# Altium project GPS_TRACKER.PrjPcb (part 2 of 2)

## Sheet SIM808+RF.SchDoc
size B; SheetNumber: 2; SheetTotal: 2
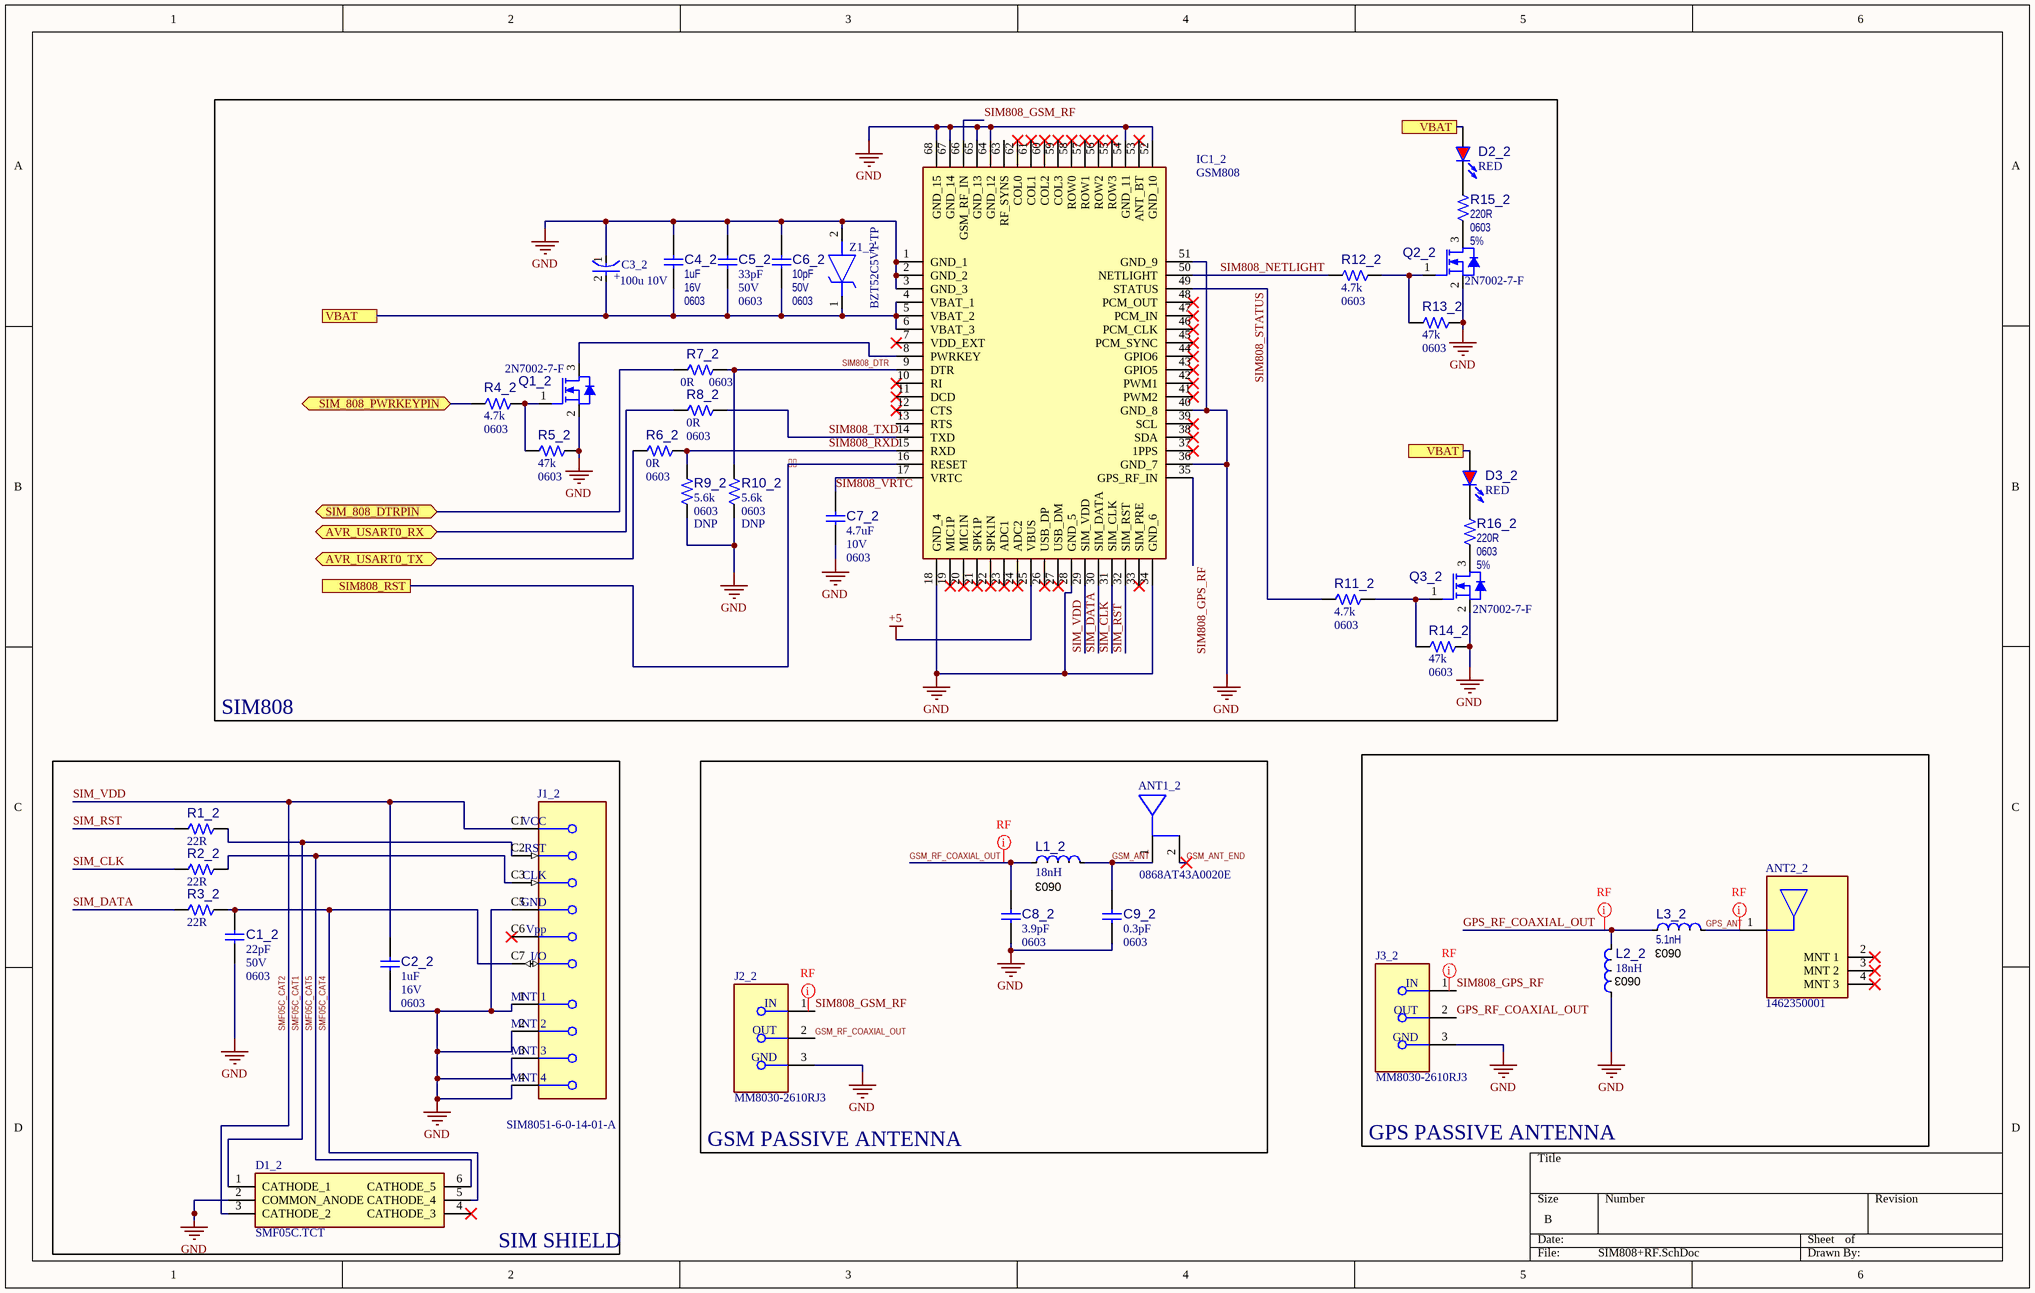
[diagram p1: SIM808+RF.SchDoc]

### Parts
ANT1_2  0868AT43A0020E  [FP-0900AT43A0070E-MFG]
ANT2_2  1462350001  [FP-1462350001-MFG]
C1_2  value 22pF  Voltage: 50V  Package: 0603  [CAP_C_0603]  (hidden comment: Capacitor NP)
C2_2  value 1uF  Voltage: 16V  Package: 0603  [CAP_C_0603]  (hidden comment: Capacitor NP)
C3_2  100u 10V  [FP-TAJC-MFG]
C4_2  value 1uF  Voltage: 16V  Package: 0603  [CAP_C_0603]  (hidden comment: Capacitor NP)
C5_2  value 33pF  Voltage: 50V  Package: 0603  [CAP_C_0603]  (hidden comment: Capacitor NP)
C6_2  value 10pF  Voltage: 50V  Package: 0603  [CAP_C_0603]  (hidden comment: Capacitor NP)
C7_2  value 4.7uF  Voltage: 10V  Package: 0603  [CAP_C_0603]  (hidden comment: Capacitor NP)
C8_2  value 3.9pF  Package: 0603  [CAP_C_0603]  (hidden comment: Capacitor NP)
C9_2  value 0.3pF  Package: 0603  [CAP_C_0603]  (hidden comment: Capacitor NP)
D1_2  SMF05C.TCT  [SOT65P210X110-6N]
D2_2  value RED  [LED_0603_RED]  (hidden comment: LED_red)
D3_2  value RED  [LED_0603_RED]  (hidden comment: LED_red)
IC1_2  GSM808  [GSM808]
J1_2  SIM8051-6-0-14-01-A  [FP-SIM8051-6-0-14-01-A-MFG]
J2_2  MM8030-2610RJ3  [FP-MM8030-2610RJ3-MFG]
J3_2  MM8030-2610RJ3  [FP-MM8030-2610RJ3-MFG]
L1_2  value 18nH  [IND_C_0603]  (hidden comment: Inductor)
L2_2  value 18nH  [IND_C_0603]  (hidden comment: Inductor)
L3_2  value 5.1nH  [IND_C_0603]  (hidden comment: Inductor)
Q1_2  value 2N7002-7-F  [SOT-23-3]  (hidden comment: Transistor MOS-N GSD)
Q2_2  value 2N7002-7-F  [SOT-23-3]  (hidden comment: Transistor MOS-N GSD)
Q3_2  value 2N7002-7-F  [SOT-23-3]  (hidden comment: Transistor MOS-N GSD)
R1_2  value 22R  [RES_C_0603]  (hidden comment: Resistor)
R2_2  value 22R  [RES_C_0603]  (hidden comment: Resistor)
R3_2  value 22R  [RES_C_0603]  (hidden comment: Resistor)
R4_2  value 4.7k  Package: 0603  [RES_C_0603]  (hidden comment: Resistor)
R5_2  value 47k  Package: 0603  [RES_C_0603]  (hidden comment: Resistor)
R6_2  value 0R  Package: 0603  [RES_C_0603]  (hidden comment: Resistor)
R7_2  value 0R  Package: 0603  [RES_C_0603]  (hidden comment: Resistor)
R8_2  value 0R  Package: 0603  [RES_C_0603]  (hidden comment: Resistor)
R9_2  value 5.6k  Package: 0603  Populated: DNP  [RES_C_0603]  (hidden comment: Resistor)
R10_2  value 5.6k  Package: 0603  Populated: DNP  [RES_C_0603]  (hidden comment: Resistor)
R11_2  value 4.7k  Package: 0603  [RES_C_0603]  (hidden comment: Resistor)
R12_2  value 4.7k  Package: 0603  [RES_C_0603]  (hidden comment: Resistor)
R13_2  value 47k  Package: 0603  [RES_C_0603]  (hidden comment: Resistor)
R14_2  value 47k  Package: 0603  [RES_C_0603]  (hidden comment: Resistor)
R15_2  value 220R  Package: 0603  Tolerance: 5%  [RES_C_0603]  (hidden comment: Resistor)
R16_2  value 220R  Package: 0603  Tolerance: 5%  [RES_C_0603]  (hidden comment: Resistor)
Z1_2  BZT52C5V1-TP  [SOD3716X135N]

### Blocks framed on the sheet
SIM808: C3_2 C4_2 C5_2 C6_2 C7_2 D2_2 D3_2 IC1_2 Q1_2 Q2_2 Q3_2 R4_2 R5_2 R6_2 R7_2 R8_2 R9_2 R10_2 R11_2 R12_2 R13_2 R14_2 R15_2 R16_2 Z1_2
SIM SHIELD: C1_2 C2_2 D1_2 J1_2 R1_2 R2_2 R3_2
GSM PASSIVE ANTENNA: ANT1_2 C8_2 C9_2 J2_2 L1_2
GPS PASSIVE ANTENNA: ANT2_2 J3_2 L2_2 L3_2

### Ports
AVR_USART0_RX (bidir), AVR_USART0_TX (bidir), SIM808_RST, SIM_808_DTRPIN (bidir), SIM_808_PWRKEYPIN (bidir), VBAT

### Nets
+5: IC1_2.25(VBUS)
GND: C1_2.1 C2_2.1 C3_2.1(C) C4_2.2 C5_2.1 C6_2.2 C7_2.1 C8_2.1 C9_2.1 D1_2.2(COMMON_ANODE) IC1_2.1(GND_1) IC1_2.2(GND_2) IC1_2.3(GND_3) IC1_2.18(GND_4) IC1_2.28(GND_5) IC1_2.34(GND_6) IC1_2.36(GND_7) IC1_2.40(GND_8) IC1_2.51(GND_9) IC1_2.52(GND_10) IC1_2.54(GND_11) IC1_2.64(GND_12) IC1_2.65(GND_13) IC1_2.67(GND_14) IC1_2.68(GND_15) J1_2.1(MNT_1) J1_2.2(MNT_2) J1_2.3(MNT_3) J1_2.4(MNT_4) J1_2.C5(GND) J2_2.3(GND) J3_2.3(GND) L2_2.1(S) Q1_2.2(S) Q2_2.2(S) Q3_2.2(S) R5_2.2 R9_2.1 R10_2.1 R13_2.2 R14_2.2 Z1_2.2(A)
VBAT: C3_2.2(A) C4_2.1 C5_2.2 C6_2.1 D2_2.1(A) D3_2.1(A) IC1_2.4(VBAT_1) IC1_2.5(VBAT_2) IC1_2.6(VBAT_3) Z1_2.1(K) ; port VBAT
: IC1_2.16(RESET) ; port SIM808_RST
AVR_USART0_RX: R8_2.1 ; port AVR_USART0_RX
AVR_USART0_TX: R6_2.1 ; port AVR_USART0_TX
GPS_ANT: ANT2_2.1(FEEDING_PAD) L3_2.2(F)
GPS_RF_COAXIAL_OUT: J3_2.2(OUT) L2_2.2(F) L3_2.1(S)
GSM_ANT: ANT1_2.1(RF_Feeding_Point) C9_2.2 L1_2.2(F)
GSM_ANT_END: ANT1_2.2(To_trace_element)
GSM_RF_COAXIAL_OUT: C8_2.2 J2_2.2(OUT) L1_2.1(S)
SIM808_DTR: IC1_2.9(DTR) R7_2.2 R10_2.2
SIM808_DTRPIN: R7_2.1 ; port SIM_808_DTRPIN
SIM808_GPS_RF: IC1_2.35(GPS_RF_IN) J3_2.1(IN)
SIM808_GSM_RF: IC1_2.66(GSM_RF_IN) J2_2.1(IN)
SIM808_NETLIGHT: IC1_2.50(NETLIGHT) R12_2.1
SIM808_PWRKEY: R4_2.1 ; port SIM_808_PWRKEYPIN
SIM808_RXD: IC1_2.15(RXD) R6_2.2 R9_2.2
SIM808_STATUS: IC1_2.49(STATUS) R11_2.1
SIM808_TXD: IC1_2.14(TXD) R8_2.2
SIM808_VRTC: C7_2.2 IC1_2.17(VRTC)
SIM_CLK: IC1_2.31(SIM_CLK) R2_2.1
SIM_DATA: IC1_2.30(SIM_DATA) R3_2.1
SIM_RST: IC1_2.32(SIM_RST) R1_2.1
SIM_VDD: C2_2.2 D1_2.3(CATHODE_2) IC1_2.29(SIM_VDD) J1_2.C1(VCC)  [also labelled SMF05C_CAT2]
SMF05C_CAT1: D1_2.1(CATHODE_1) J1_2.C2(RST) R1_2.2
SMF05C_CAT4: C1_2.2 D1_2.5(CATHODE_4) J1_2.C7(I/O) R3_2.2
SMF05C_CAT5: D1_2.6(CATHODE_5) J1_2.C3(CLK) R2_2.2
NetD2_2_2: D2_2.2(K) R15_2.2
NetD3_2_2: D3_2.2(K) R16_2.2
NetIC1_2_8: IC1_2.8(PWRKEY) Q1_2.3(D)
NetQ1_2_1: Q1_2.1(G) R4_2.2 R5_2.1
NetQ2_2_1: Q2_2.1(G) R12_2.2 R13_2.1
NetQ2_2_3: Q2_2.3(D) R15_2.1
NetQ3_2_1: Q3_2.1(G) R11_2.2 R14_2.1
NetQ3_2_3: Q3_2.3(D) R16_2.1

Not connected (* = marked no-connect by the designer): ANT2_2 2(MNT_1)* 3(MNT_2)* 4(MNT_3)*; D1_2 4(CATHODE_3)*; IC1_2 7(VDD_EXT)* 10(RI)* 11(DCD)* 12(CTS)* 13(RTS) 19(MIC1P)* 20(MIC1N)* 21(SPK1P)* 22(SPK1N)* 23(ADC1)* 24(ADC2)* 26(USB_DP)* 27(USB_DM)* 33(SIM_PRE)* 37(1PPS)* 38(SDA)* 39(SCL)* 41(PWM2)* 42(PWM1)* 43(GPIO5)* 44(GPIO6)* 45(PCM_SYNC)* 46(PCM_CLK)* 47(PCM_IN)* 48(PCM_OUT)* 53(ANT_BT)* 55(ROW3)* 56(ROW2)* 57(ROW1)* 58(ROW0)* 59(COL3)* 60(COL2)* 61(COL1)* 62(COL0)* 63(RF_SYNS); J1_2 C6(Vpp)*

### Layout directives
net class RF: (no net found under the mark), GPS_ANT, GPS_RF_COAXIAL_OUT, GSM_RF_COAXIAL_OUT

### Notes on the sheet
- (near L1_2) 0603
- (near L2_2) 0603
- (near L3_2) 0603
- (in symbol CMP-2100-03690-2) +

### Library data of the parts
ANT1_2 = CMP-56579-000002-1: RF ANT CHIP SOLDER SMD; Impedance: 50R; Max Frequency: 928MHz; Number of Pins: 2; Mount: Surface Mount; RoHS Compliant: No; Contact Plating: Tin
ANT2_2 = CMP-04721-000004-1: RF ANT 1.575GHZ MOLDED SLDR SMD; Manufacturer: Molex; Gain: 1.1dB; Power Rating: 2W; Number Of Bands: 3; Impedance: 50Ω; Max Frequency: 1607MHz; Return Loss: -8dB; Manufacturer Part Number: 1462350001; Height: 4.1mm; ComponentLink2URL: https://www.molex.com/pdm_docs/sd/1462350001_sd.pdf; Automotive: No; Temperature: -40°C to +125°C; Package: 1462350001; Octopart: https://octopart.com/146235-0001-molex-75198029; Temperature Range Low: -40°C; Digikey Description: RF ANT 1.575GHZ MOLDED SLDR SMD; Device Class L1: Integrated Circuits (ICs); Device Class L3: RF Antennas; Temperature Range High: +125°C; RoHS: TRUE; Device Class L2: RF Semiconductors and Devices; Lead Free: Yes; ComponentLink2Description: Datasheet; Category: Ant
C1_2 = CAP0074: Manufacturer 1: Cal-Chip; Manufacturer Part Number 1: GMC10CG220J50NTLF; Description_: CAP CER 22pF 50V 5% NP0 SMD 0603; Dev Tools Status: Production; Tolerance: 5%; Temperature Coefficient: NP0; Type: Ceramic; Populated: Yes; MCHP-ID: CAP0074; Revision: 3; Symbol: Capacitor NP; Status: MCL Design; ComponentLink1URL: https://chn-vm-apps.microchip.com/mchprepo/parts/Datasheets/ECJ__General_.pdf; ComponentLink1Description: SVN Datasheet; ComponentLink2URL: C:\ALTIUM_WORK\00001_MCHP-CDB\Datasheets\ECJ__General_.pdf; ComponentLink2Description: Local Datasheet; ComponentLink3URL: C:\ALTIUM_WORK\00001_MCHP-CDB\Library\LibraryRefs\Capacitor NP.SchLib; ComponentLink3Description: Open Symbol; ComponentLink4URL: C:\ALTIUM_WORK\00001_MCHP-CDB\Library\Footprints\CAP_C_0603.PcbLib; ComponentLink4Description: Open Footprint; ComponentLink5Description: Open Footprint 2; ComponentLink6Description: Open Footprint 3; ComponentLink7Description: Open Footprint 4; Operating Temperature: -55C to +125C; Category: Capacitor; Manufacturer 2: Panasonic; Manufacturer Part Number 2: ECJ-1VC1H220J; Manufacturer 3: Panasonic; Manufacturer Part Number 3: ECU-V1H220JCV; Manufacturer 4: Yageo; Manufacturer Part Number 4: 0603CG220J9B200; Manufacturer 5: Yageo; Manufacturer Part Number 5: CC0603JRNP09BN220; Manufacturer 6: NIC Components; Manufacturer Part Number 6: NMC0603NPO220J50TRPF; Manufacturer 7: Samsung Electro-Mechanics; Manufacturer Part Number 7: CL10C220JB8NNNC; Manufacturer 8: Yageo; Manufacturer Part Number 8: CC0603JRNPO9BN220; Supplier 1: Cal-Chip; Supplier Part Number 1: GMC10CG220J50NTLF; Supplier 2: Digi-Key; Supplier Part Number 2: PCC220ACVTR-ND; Supplier 3: Digi-Key; Supplier Part Number 3: 311-1062-1-ND; Supplier 4: NIC Components; Supplier Part Number 4: NMC0603NPO220J50TRPF; Supplier 5: Samsung Electro-Mechanics; Supplier Part Number 5: CL10C220JB8NNNC; Supplier 6: Yageo; Supplier Part Number 6: CC0603JRNPO9BN220; Quantity Override: 1
C2_2 C4_2 = CAP0265: Manufacturer 1: D5_AVX; Manufacturer Part Number 1: 0603YD105KAT2A; Description_: CAP CER 1uF 16V 10% X5R SMD 0603; Dev Tools Status: Production; Tolerance: 10%; Temperature Coefficient: X5R; Type: Ceramic; Populated: Yes; MCHP-ID: CAP0265; Revision: 6; Symbol: Capacitor NP; Status: MCL Design; ComponentLink1URL: https://chn-vm-apps.microchip.com/mchprepo/parts/Datasheets/smccp.pdf; ComponentLink1Description: SVN Datasheet; ComponentLink2URL: C:\ALTIUM_WORK\00001_MCHP-CDB\Datasheets\smccp.pdf; ComponentLink2Description: Local Datasheet; ComponentLink3URL: C:\ALTIUM_WORK\00001_MCHP-CDB\Library\LibraryRefs\Capacitor NP.SchLib; ComponentLink3Description: Open Symbol; ComponentLink4URL: C:\ALTIUM_WORK\00001_MCHP-CDB\Library\Footprints\CAP_C_0603.PcbLib; ComponentLink4Description: Open Footprint; ComponentLink5Description: Open Footprint 2; ComponentLink6Description: Open Footprint 3; ComponentLink7Description: Open Footprint 4; Operating Temperature: -55C to +85C; Category: Capacitor; Manufacturer 2: KEMET; Manufacturer Part Number 2: C0603C105K4PACTU; Manufacturer 3: TDK Corporation; Manufacturer Part Number 3: C1608X5R1C105K080AA; Manufacturer 4: Vishay; Manufacturer Part Number 4: VJ0603G105KXJCW1BC; Manufacturer 5: Yageo; Manufacturer Part Number 5: CC0603KRX5R7BB105; Supplier 1: Digi-Key; Supplier Part Number 1: 478-1249-1-ND; Supplier 2: Digi-Key; Supplier Part Number 2: 399-5090-1-ND; Supplier 3: Digi-Key; Supplier Part Number 3: 445-1416-1-ND; Supplier 4: Digi-Key; Supplier Part Number 4: 720-1851-1-ND; Supplier 5: Digi-Key; Supplier Part Number 5: 311-1444-1-ND; Quantity Override: 1
C3_2 = CMP-2100-03690-2: 100uF 10V  ±10% 1.2Ω 2312  SMD Tantalum Capacitor; Leakage Current: 10uA; Polarity: Polar; Dissipation Factor: 8%; ESR (Equivalent Series Resistance): 1.2R; Series: TAJ; Number of Pins: 2; Dielectric Material: Tantalum; Lead Free: Lead Free; Tolerance: 10%; REACH SVHC: No SVHC; Case Code (Metric): 6032; Length: 6mm; Package Quantity: 1; Case Code (Imperial): 2412; RoHS Compliant: Yes; Case/Package: Molded; Max Operating Temperature: 125°C; Termination: SMD/SMT; Width: 3.2mm; Voltage: 10V; Construction: Flat; Min Operating Temperature: -55°C; Height: 2.6mm; Height - Seated (Max): 0.11inch; Voltage Rating (DC): 10V; Capacitance: 100uF; Features: General Purpose; Mount: Surface Mount; Packaging: Tape and Reel; Voltage Rating: 10V; Depth: 3.2mm; Radiation Hardening: No
C5_2 = CAP0088: Manufacturer 1: Cal-Chip; Manufacturer Part Number 1: GMC10CG330J50NTLF; Description_: CAP CER 33pF 50V 5% NP0 SMD 0603; Dev Tools Status: Production; Tolerance: 5%; Temperature Coefficient: NP0; Type: Ceramic; Populated: Yes; MCHP-ID: CAP0088; Revision: 4; Symbol: Capacitor NP; Status: MCL Design; ComponentLink1URL: https://chn-vm-apps.microchip.com/mchprepo/parts/Datasheets/KEM_C1002_X7R_SMD.pdf; ComponentLink1Description: SVN Datasheet; ComponentLink2URL: C:\ALTIUM_WORK\00001_MCHP-CDB\Datasheets\KEM_C1002_X7R_SMD.pdf; ComponentLink2Description: Local Datasheet; ComponentLink3URL: C:\ALTIUM_WORK\00001_MCHP-CDB\Library\LibraryRefs\Capacitor NP.SchLib; ComponentLink3Description: Open Symbol; ComponentLink4URL: C:\ALTIUM_WORK\00001_MCHP-CDB\Library\Footprints\CAP_C_0603.PcbLib; ComponentLink4Description: Open Footprint; ComponentLink5Description: Open Footprint 2; ComponentLink6Description: Open Footprint 3; ComponentLink7Description: Open Footprint 4; Operating Temperature: -55C to +125C; Category: Capacitor; Manufacturer 2: KEMET; Manufacturer Part Number 2: C0603C330J5GACTU; Manufacturer 3: Panasonic; Manufacturer Part Number 3: ECU-V1H330JCV; Manufacturer 4: TDK Corporation; Manufacturer Part Number 4: C1608C0G1H330J; Manufacturer 5: Yageo; Manufacturer Part Number 5: CC0603JRNP09BN330; Manufacturer 6: NIC Components; Manufacturer Part Number 6: NMC0603NPO330J50TRPF; Manufacturer 7: Panasonic; Manufacturer Part Number 7: ECJ-1VC1H330J; Manufacturer 8: Samsung Electro-Mechanics; Manufacturer Part Number 8: CL10C330JB8NNNC; Manufacturer 9: Yageo; Manufacturer Part Number 9: CC0603JRNPO9BN330; Supplier 1: Cal-Chip; Supplier Part Number 1: GMC10CG330J50NTLF; Supplier 2: Digi-Key; Supplier Part Number 2: 399-1055-1-ND; Supplier 3: Digi-Key; Supplier Part Number 3: PCC330ACVTR-ND; Supplier 4: Digi-Key; Supplier Part Number 4: 445-1275-2-ND; Supplier 5: Digi-Key; Supplier Part Number 5: 311-1064-1-ND; Supplier 6: NIC Components; Supplier Part Number 6: NMC0603NPO330J50TRPF; Supplier 7: Panasonic; Supplier Part Number 7: ECJ-1VC1H330J; Supplier 8: Samsung Electro-Mechanics; Supplier Part Number 8: CL10C330JB8NNNC; Supplier 9: Yageo; Supplier Part Number 9: CC0603JRNPO9BN330; Quantity Override: 1
C6_2 = CAP1048: Manufacturer 1: TDK Corporation; Manufacturer Part Number 1: C1608C0G1H100D; Description_: CAP CER 10pF 50V 0.5pF C0G SMD 0603; Dev Tools Status: Production; Tolerance: 0.5pF; Temperature Coefficient: C0G; Type: Ceramic; Owner: Leah Whitaker; Populated: YES; MCHP-ID: CAP1048; Revision: 4; Symbol: Capacitor NP; Status: MCL Design; ComponentLink1URL: https://chn-vm-apps.microchip.com/mchprepo/parts/Datasheets/general_B11.pdf; ComponentLink1Description: SVN Datasheet; ComponentLink2URL: C:\ALTIUM_WORK\00001_MCHP-CDB\Datasheets\general_B11.pdf; ComponentLink2Description: Local Datasheet; ComponentLink3URL: C:\ALTIUM_WORK\00001_MCHP-CDB\Library\LibraryRefs\Capacitor NP.SchLib; ComponentLink3Description: Open Symbol; ComponentLink4URL: C:\ALTIUM_WORK\00001_MCHP-CDB\Library\Footprints\CAP_C_0603.PcbLib; ComponentLink4Description: Open Footprint; ComponentLink5Description: Open Footprint 2; ComponentLink6Description: Open Footprint 3; ComponentLink7Description: Open Footprint 4; Operating Temperature: -55C to +125C; Category: Capacitor; Manufacturer 2: Samsung Electro-Mechanics; Manufacturer Part Number 2: CL10C100DB8NNNC; Manufacturer 3: Yageo; Manufacturer Part Number 3: CC0603DRNPO9BN100; Supplier 1: Digi-Key; Supplier Part Number 1: 445-1269-1-ND; Supplier 2: Samsung Electro-Mechanics; Supplier Part Number 2: CL10C100DB8NNNC; Supplier 3: Yageo; Supplier Part Number 3: CC0603DRNPO9BN100; Quantity Override: 1
C7_2 = CAP0384: Manufacturer 1: Murata; Manufacturer Part Number 1: GRM188F51A475ZE20D; Description_: CAP CER 4.7uF 10V 80% Y5V SMD 0603; Dev Tools Status: Production; Tolerance: 80%; Temperature Coefficient: Y5V; Type: Ceramic; Populated: Yes; MCHP-ID: CAP0384; Revision: 2; Symbol: Capacitor NP; Status: MCL Design; ComponentLink1URL: https://chn-vm-apps.microchip.com/mchprepo/parts/Datasheets/L0005E.pdf; ComponentLink1Description: SVN Datasheet; ComponentLink2URL: C:\ALTIUM_WORK\00001_MCHP-CDB\Datasheets\L0005E.pdf; ComponentLink2Description: Local Datasheet; ComponentLink3URL: C:\ALTIUM_WORK\00001_MCHP-CDB\Library\LibraryRefs\Capacitor NP.SchLib; ComponentLink3Description: Open Symbol; ComponentLink4URL: C:\ALTIUM_WORK\00001_MCHP-CDB\Library\Footprints\CAP_C_0603.PcbLib; ComponentLink4Description: Open Footprint; ComponentLink5Description: Open Footprint 2; ComponentLink6Description: Open Footprint 3; ComponentLink7Description: Open Footprint 4; Operating Temperature: -30C to +85C; Category: Capacitor; Manufacturer 2: Taiyo Yuden; Manufacturer Part Number 2: JMK107BJ475KA-T; Supplier 1: Digi-Key; Supplier Part Number 1: 490-3302-1-ND; Supplier 2: Digi-Key; Supplier Part Number 2: 587-1785-1-nd; Quantity Override: 1
C8_2 C9_2 = CAP1229: Manufacturer 1: Murata; Manufacturer Part Number 1: GRM1885C1H3R3CA01D; Description_: CAP CER 3.3pF 50V 0.25pF NP0 SMD 0603; Dev Tools Status: Production; Tolerance: 0.25pF; Temperature Coefficient: NP0; Type: Ceramic; Populated: YES; MCHP-ID: CAP1229; Revision: 1; Symbol: Capacitor NP; Status: MCL Design; ComponentLink1URL: https://chn-vm-apps.microchip.com/mchprepo/parts/Datasheets/c02e.pdf; ComponentLink1Description: SVN Datasheet; ComponentLink2URL: C:\ALTIUM_WORK\00001_MCHP-CDB\Datasheets\c02e.pdf; ComponentLink2Description: Local Datasheet; ComponentLink3URL: C:\ALTIUM_WORK\00001_MCHP-CDB\Library\LibraryRefs\Capacitor NP.SchLib; ComponentLink3Description: Open Symbol; ComponentLink4URL: C:\ALTIUM_WORK\00001_MCHP-CDB\Library\Footprints\CAP_C_0603.PcbLib; ComponentLink4Description: Open Footprint; ComponentLink5Description: Open Footprint 2; ComponentLink6Description: Open Footprint 3; ComponentLink7Description: Open Footprint 4; Operating Temperature: -55C to +125C; Category: Capacitor; Manufacturer 2: Samsung Electro-Mechanics; Manufacturer Part Number 2: CL10C3R3CB8NNNC; Supplier 1: Digi-Key; Supplier Part Number 1: 490-10717-1-ND; Supplier 2: Samsung Electro-Mechanics; Supplier Part Number 2: CL10C3R3CB8NNNC; Quantity Override: 1
D1_2 = SMF05C.TCT: TVS Diode (Uni-directional); Manufacturer_Name: SEMTECH; Datasheet Link: https://www.mouser.co.uk/datasheet/2/761/smf05c-1278099.pdf; Height: 1.1mm; Manufacturer_Part_Number: SMF05C.TCT; Mouser Part Number: 947-SMF05C.TCT; Mouser Price/Stock: https://www.mouser.co.uk/ProductDetail/Semtech/SMF05CTCT?qs=rBWM4%252BvDhIcdGOAFdL4XAA%3D%3D; Arrow Part Number: SMF05C.TCT; Arrow Price/Stock: https://www.arrow.com/en/products/smf05c.tct/semtech?region=nac
D2_2 D3_2 = LED0063: LED; Manufacturer 1: Lite-On; Manufacturer Part Number 1: LTST-C190KRKT; Description_: DIO LED RED 1.8V 40mA 10mcd Clear SMD 0603; Dev Tools Status: Production; Type: LED Single; Forward Current: 40mA; Power: 100mW; Reverse Current: 100uA; Reverse Voltage: 5V; Populated: YES; MCHP-ID: LED0063; Revision: 1; Symbol: LED_red; Status: MCL Design; Package: 0603; ComponentLink1URL: https://chn-vm-apps.microchip.com/mchprepo/parts/Datasheets/LTST-C190CKT.pdf; ComponentLink1Description: SVN Datasheet; ComponentLink2URL: C:\ALTIUM_WORK\00001_MCHP-CDB\Datasheets\LTST-C190CKT.pdf; ComponentLink2Description: Local Datasheet; ComponentLink3URL: C:\ALTIUM_WORK\00001_MCHP-CDB\Library\LibraryRefs\LED_red.SchLib; ComponentLink3Description: Open Symbol; ComponentLink4URL: C:\ALTIUM_WORK\00001_MCHP-CDB\Library\Footprints\LED_0603_RED.PcbLib; ComponentLink4Description: Open Footprint; ComponentLink5Description: Open Footprint 2; ComponentLink6Description: Open Footprint 3; ComponentLink7Description: Open Footprint 4; Operating Temperature: -55C to +85C; Category: Diode; Manufacturer 2: Lite-On; Manufacturer Part Number 2: LTST-C190CKT; Supplier 1: Digi-Key; Supplier Part Number 1: 160-1436-1-ND; Supplier 2: Digi-Key; Supplier Part Number 2: 160-1181-1-ND; Quantity Override: 1
IC1_2 = GSM808: Integrated Circuit; Manufacturer_Name: SIMCOM; Datasheet Link: https://cdn-shop.adafruit.com/datasheets/SIM808_Hardware+Design_V1.00.pdf; Height: 2.8mm; Manufacturer_Part_Number: GSM808
J1_2 = CMP-245159-000001-1: NANO SIM PUSH PULL, 6P, SMT, 1.3; Manufacturer: GCT; Conn Orientation: Right Angle; Voltage Rating: 30V; Current Rating: 0.5A; Pitch: 2.54mm; Number Of Contacts: 6; Is Female: yes; ComponentLink2Description: Datasheet; Category: Conn; Manufacturer Part Number: SIM8051-6-0-14-01-A; Temperature: -40°C to +85°C; Contact Material: Gold,Nickel; Package: SIM8051-6-0-14-01-A; RoHS: TRUE; Digikey Description: NANO SIM PUSH PULL, 6P, SMT, 1.3; Automotive: No; Device Class L3: unset; ComponentLink2URL: https://gct.co/files/drawings/sim8051.pdf; Lead Free: Yes; Device Class L1: Connectors; Device Class L2: Memory Connectors; Height: 1.5mm; Temperature Range High: +85°C; Octopart: https://octopart.com/sim8051-6-0-14-01-a-gct-99340323; Temperature Range Low: -40°C
J2_2 J3_2 = CMP-06171-000005-1: CONN SWG RCPT STR 50 OHM SMD; Operating Frequency: 0 to 11 GHz; Body Material: Copper; Insulation Resistance: 500MR; Voltage Rating: 250V; Impedance: 50R; Connector Type: Socket; Max Frequency: 11GHz; Polarity: Standard; Package Quantity: 1; RoHS Compliant: No; Fastening Type: Pull; Orientation: Straight; Mount: Surface Mount; Case/Package: SMD/SMT; Packaging: Tape and Reel; Termination: Solder; Min Operating Temperature: -40°C; Length: 2.1mm; Housing Color: Gold; Series: 8030; Lead Free: Lead Free; Depth: 2mm; Max Operating Temperature: 85°C; Frequency: 11GHz; Contact Plating: Gold
L1_2 L2_2 = IND0008: Manufacturer 1: TOKO America; Manufacturer Part Number 1: LL1608-FSL15NJ; Description_: INDUCTOR 15nH 600mA 5% SMD 0603; Dev Tools Status: Production; DCR: 0.32R; Saturation Current: 600mA; Test Frequency: 100MHz; Populated: Yes; MCHP-ID: IND0008; Revision: 1; Symbol: Inductor; Status: MCL Design; ComponentLink1URL: https://chn-vm-apps.microchip.com/mchprepo/parts/Datasheets/LL1608-FH.pdf; ComponentLink1Description: SVN Datasheet; ComponentLink2URL: C:\ALTIUM_WORK\00001_MCHP-CDB\Datasheets\LL1608-FH.pdf; ComponentLink2Description: Local Datasheet; ComponentLink3URL: C:\ALTIUM_WORK\00001_MCHP-CDB\Library\LibraryRefs\Inductor.SchLib; ComponentLink3Description: Open Symbol; ComponentLink4URL: C:\ALTIUM_WORK\00001_MCHP-CDB\Library\Footprints\IND_C_0603.PcbLib; ComponentLink4Description: Open Footprint; ComponentLink5Description: Open Footprint 2; ComponentLink6Description: Open Footprint 3; ComponentLink7Description: Open Footprint 4; Operating Temperature: -40C to +100C; Package: 0603; Type: Inductor; Category: Inductor; Manufacturer 2: TOKO America; Manufacturer Part Number 2: LL1608-FH15NJ; Supplier 1: Digi-Key; Supplier Part Number 1: LL1608-FSL15NJ-ND; Supplier 2: Digi-Key; Supplier Part Number 2: TKS3713TR-ND; Quantity Override: 1
L3_2 = IND1285: Manufacturer 1: Murata; Manufacturer Part Number 1: LQM18PN4R7MFRL; Description_: INDUCTOR 4.7uH 620mA 20% SMD 0603; Dev Tools Status: Production; Owner: Gabor Bihari; DCR: 0.55R; RMS Current: 620mA; Test Frequency: 1MHz; Populated: YES; MCHP-ID: IND1285; Revision: 2; Symbol: Inductor; Status: MCL Design; ComponentLink1URL: https://chn-vm-apps.microchip.com/mchprepo/parts/Datasheets/o05e.pdf; ComponentLink1Description: SVN Datasheet; ComponentLink2URL: C:\ALTIUM_WORK\00001_MCHP-CDB\Datasheets\o05e.pdf; ComponentLink2Description: Local Datasheet; ComponentLink3URL: C:\ALTIUM_WORK\00001_MCHP-CDB\Library\LibraryRefs\Inductor.SchLib; ComponentLink3Description: Open Symbol; ComponentLink4URL: C:\ALTIUM_WORK\00001_MCHP-CDB\Library\Footprints\IND_C_0603.PcbLib; ComponentLink4Description: Open Footprint; ComponentLink5Description: Open Footprint 2; ComponentLink6Description: Open Footprint 3; ComponentLink7Description: Open Footprint 4; Operating Temperature: -40°C to 85°C; Package: 0603; Type: Inductor; Category: Inductor; Supplier 1: Digi-Key; Supplier Part Number 1: 490-12065-2-ND; Supplier 2: Digi-Key; Supplier Part Number 2: 490-12065-1-ND; Quantity Override: 1
Q1_2 Q2_2 Q3_2 = TRA1102: Transistor MOS; Manufacturer 1: Diodes Inc; Description_: TRANS FET N-CH 2N7002-7-F 60V 170mA 370mW SOT-23-3; Dev Tools Status: Production; Type: FET; Current: 170mA; Drain to Source Voltage: 60V; Gate to Source Voltage: 20V; Power: 370mW; Owner: Adrian M (M91404); Populated: YES; MCHP-ID: TRA1102; Revision: 0; Symbol: Transistor MOS-N GSD; Status: MCL Design; Package: SOT-23-3; ComponentLink1URL: https://chn-vm-apps.microchip.com/mchprepo/parts/Datasheets/ds11303.pdf; ComponentLink1Description: SVN Datasheet; ComponentLink2URL: C:\ALTIUM_WORK\00001_MCHP-CDB\Datasheets\ds11303.pdf; ComponentLink2Description: Local Datasheet; ComponentLink3URL: C:\ALTIUM_WORK\00001_MCHP-CDB\Library\LibraryRefs\Transistor MOS-N GSD.SchLib; ComponentLink3Description: Open Symbol; ComponentLink4URL: C:\ALTIUM_WORK\00001_MCHP-CDB\Library\Footprints\SOT-23-3.PcbLib; ComponentLink4Description: Open Footprint; ComponentLink5Description: Open Footprint 2; ComponentLink6Description: Open Footprint 3; ComponentLink7Description: Open Footprint 4; Operating Temperature: -55C to +150C; Category: Transistor; Manufacturer Part Number 1: 2N7002-7-F; Supplier 1: Digi-Key; Supplier Part Number 1: 2N7002-FDICT-ND; Quantity Override: 1
R1_2 R2_2 R3_2 = RES1560: Manufacturer 1: Panasonic Electronic Components; Manufacturer Part Number 1: ERJ-3EKF22R0V; Description_: RES TKF 22R 1% 1/10W SMD 0603; Dev Tools Status: Production; Voltage: 75V; Temperature Coefficient: 100ppm/C; Power: 1/10W; Populated: YES; MCHP-ID: RES1560; Revision: 1; Symbol: Resistor; Status: MCL Design; ComponentLink1URL: https://chn-vm-apps.microchip.com/mchprepo/parts/Datasheets/AOA0000CE2.pdf; ComponentLink1Description: SVN Datasheet; ComponentLink2URL: C:\ALTIUM_WORK\00001_MCHP-CDB\Datasheets\AOA0000CE2.pdf; ComponentLink2Description: Local Datasheet; ComponentLink3URL: C:\ALTIUM_WORK\00001_MCHP-CDB\Library\LibraryRefs\Resistor.SchLib; ComponentLink3Description: Open Symbol; ComponentLink4URL: C:\ALTIUM_WORK\00001_MCHP-CDB\Library\Footprints\RES_C_0603.PcbLib; ComponentLink4Description: Open Footprint; ComponentLink5Description: Open Footprint 2; ComponentLink6Description: Open Footprint 3; ComponentLink7Description: Open Footprint 4; Operating Temperature: -55C to +155C; Category: Resistor; Type: RES SMD; Composition: TKF; Supplier 1: Digi-Key; Supplier Part Number 1: P22.0HCT-ND; Quantity Override: 1
R4_2 R11_2 R12_2 = RES1178: Manufacturer 1: Panasonic; Manufacturer Part Number 1: ERJ-3GEYJ472V; Description_: RES TKF 4.7k 5% 1/10W SMD 0603; Dev Tools Status: Production; Voltage: 75V; Temperature Coefficient: 200ppm/C; Power: 1/10W; Owner: Bogdan P (M91398); Populated: Yes; MCHP-ID: RES1178; Revision: 0; Symbol: Resistor; Status: MCL Design; ComponentLink1URL: https://chn-vm-apps.microchip.com/mchprepo/parts/Datasheets/AOA0000CE1.pdf; ComponentLink1Description: SVN Datasheet; ComponentLink2URL: C:\ALTIUM_WORK\00001_MCHP-CDB\Datasheets\AOA0000CE1.pdf; ComponentLink2Description: Local Datasheet; ComponentLink3URL: C:\ALTIUM_WORK\00001_MCHP-CDB\Library\LibraryRefs\Resistor.SchLib; ComponentLink3Description: Open Symbol; ComponentLink4URL: C:\ALTIUM_WORK\00001_MCHP-CDB\Library\Footprints\RES_C_0603.PcbLib; ComponentLink4Description: Open Footprint; ComponentLink5Description: Open Footprint 2; ComponentLink6Description: Open Footprint 3; ComponentLink7Description: Open Footprint 4; Operating Temperature: -55C to +155C; Category: Resistor; Type: RES SMD; Composition: TKF; Supplier 1: Digi-Key; Supplier Part Number 1: P4.7KGCT-ND; Quantity Override: 1
R5_2 R13_2 R14_2 = RES1183: Manufacturer 1: Panasonic; Manufacturer Part Number 1: ERJ-3EKF4702V; Description_: RES TKF 47k 1% 1/10W SMD 0603; Dev Tools Status: Production; Voltage: 75V; Temperature Coefficient: 100ppm/C; Power: 1/10W; Owner: Adrian M (M91404); Populated: YES; MCHP-ID: RES1183; Revision: 0; Symbol: Resistor; Status: MCL Design; ComponentLink1URL: https://chn-vm-apps.microchip.com/mchprepo/parts/Datasheets/AOA0000CE2.pdf; ComponentLink1Description: SVN Datasheet; ComponentLink2URL: C:\ALTIUM_WORK\00001_MCHP-CDB\Datasheets\AOA0000CE2.pdf; ComponentLink2Description: Local Datasheet; ComponentLink3URL: C:\ALTIUM_WORK\00001_MCHP-CDB\Library\LibraryRefs\Resistor.SchLib; ComponentLink3Description: Open Symbol; ComponentLink4URL: C:\ALTIUM_WORK\00001_MCHP-CDB\Library\Footprints\RES_C_0603.PcbLib; ComponentLink4Description: Open Footprint; ComponentLink5Description: Open Footprint 2; ComponentLink6Description: Open Footprint 3; ComponentLink7Description: Open Footprint 4; Operating Temperature: -55C to +155C; Category: Resistor; Type: RES SMD; Composition: TKF; Supplier 1: Digi-Key; Supplier Part Number 1: P47.0KHCT-ND; Quantity Override: 1
R6_2 R7_2 R8_2 = RES2360: Manufacturer 1: Panasonic Electronic Components; Manufacturer Part Number 1: ERJ-3GEY0R00V; Description_: RES TKF 0R 1/10W SMD 0603 AEC-Q200; Dev Tools Status: Production; Circuit Type: Isolated; Power: 1/10W; Owner: Steve Dziaba; Populated: YES; MCHP-ID: RES2360; Revision: 1; Symbol: Resistor; Status: MCL Design; ComponentLink1URL: https://chn-vm-apps.microchip.com/mchprepo/parts/Datasheets/ERJ-3GEY0R00V.pdf; ComponentLink1Description: SVN Datasheet; ComponentLink2URL: C:\ALTIUM_WORK\00001_MCHP-CDB\Datasheets\ERJ-3GEY0R00V.pdf; ComponentLink2Description: Local Datasheet; ComponentLink3URL: C:\ALTIUM_WORK\00001_MCHP-CDB\Library\LibraryRefs\Resistor.SchLib; ComponentLink3Description: Open Symbol; ComponentLink4URL: C:\ALTIUM_WORK\00001_MCHP-CDB\Library\Footprints\RES_C_0603.PcbLib; ComponentLink4Description: Open Footprint; ComponentLink5Description: Open Footprint 2; ComponentLink6Description: Open Footprint 3; ComponentLink7Description: Open Footprint 4; Category: Resistor; Type: RES SMD; Composition: TKF; Manufacturer 2: Vishay; Manufacturer Part Number 2: CRCW06030000Z0EB; Supplier 1: Digi-Key; Supplier Part Number 1: P0.0GCT-ND; Supplier 2: Digi-Key; Supplier Part Number 2: 541-2968-1-ND; Quantity Override: 1
R9_2 R10_2 = RSMT0752: Manufacturer 1: Yageo; Manufacturer Part Number 1: RC0603FR-075K6L; Description_: RES TKF 5.6k 1% 1/10W SMD 0603; Dev Tools Status: Production; Voltage: 50V; Temperature Coefficient: 100ppm/C; Power: 1/10W; MCHP-ID: RSMT0752; Revision: 1; Symbol: Resistor; Status: MCL Design; ComponentLink1URL: https://chn-vm-apps.microchip.com/mchprepo/parts/Datasheets/PYu-RC0603_51_RoHS_L_4.pdf; ComponentLink1Description: SVN Datasheet; ComponentLink2URL: C:\ALTIUM_WORK\00001_MCHP-CDB\Datasheets\PYu-RC0603_51_RoHS_L_4.pdf; ComponentLink2Description: Local Datasheet; ComponentLink3URL: C:\ALTIUM_WORK\00001_MCHP-CDB\Library\LibraryRefs\Resistor.SchLib; ComponentLink3Description: Open Symbol; ComponentLink4URL: C:\ALTIUM_WORK\00001_MCHP-CDB\Library\Footprints\RES_C_0603.PcbLib; ComponentLink4Description: Open Footprint; ComponentLink5Description: Open Footprint 2; ComponentLink6Description: Open Footprint 3; ComponentLink7Description: Open Footprint 4; Operating Temperature: -55C to +155C; Category: Resistor; Type: RES SMD; Composition: TKF; Supplier 1: Digi-Key; Supplier Part Number 1: 311-5.60KHRCT-ND; Quantity Override: 1
R15_2 R16_2 = RES0194: Manufacturer 1: ROHM; Manufacturer Part Number 1: MCR03EZPJ221; Description_: RES TKF 220R 5% 1/10W SMD 0603; Dev Tools Status: Production; Voltage: 50V; Temperature Coefficient: 100ppm/C; Power: 1/10W; Populated: Yes; MCHP-ID: RES0194; Revision: 1; Symbol: Resistor; Status: MCL Design; ComponentLink1URL: https://chn-vm-apps.microchip.com/mchprepo/parts/Datasheets/mcr_a.pdf; ComponentLink1Description: SVN Datasheet; ComponentLink2URL: C:\ALTIUM_WORK\00001_MCHP-CDB\Datasheets\mcr_a.pdf; ComponentLink2Description: Local Datasheet; ComponentLink3URL: C:\ALTIUM_WORK\00001_MCHP-CDB\Library\LibraryRefs\Resistor.SchLib; ComponentLink3Description: Open Symbol; ComponentLink4URL: C:\ALTIUM_WORK\00001_MCHP-CDB\Library\Footprints\RES_C_0603.PcbLib; ComponentLink4Description: Open Footprint; ComponentLink5Description: Open Footprint 2; ComponentLink6Description: Open Footprint 3; ComponentLink7Description: Open Footprint 4; Operating Temperature: -55C to +155C; Category: Resistor; Type: RES SMD; Composition: TKF; Supplier 1: Digi-Key; Supplier Part Number 1: RHM220GCT-ND; Quantity Override: 1
Z1_2 = BZT52C5V1-TP: Zener Diode; Manufacturer_Name: Micro Commercial Components (MCC); Datasheet Link: https://componentsearchengine.com/Datasheets/2/BZT52C5V1-TP.pdf; Height: 1.35mm; Manufacturer_Part_Number: BZT52C5V1-TP; Mouser Part Number: 833-BZT52C5V1-TP; Mouser Price/Stock: https://www.mouser.co.uk/ProductDetail/Micro-Commercial-Components-MCC/BZT52C5V1-TP?qs=ZNK0BnemlqGS%2FcMHrWMpww%3D%3D; Arrow Part Number: BZT52C5V1-TP; Arrow Price/Stock: https://www.arrow.com/en/products/bzt52c5v1-tp/micro-commercial-components?region=nac

## Nets that join several sheets
+5: MCU+Power_Supply+Accel (7 pins), SIM808+RF (IC1_2.25)
GND: MCU+Power_Supply+Accel (35 pins), SIM808+RF (42 pins)
VBAT: MCU+Power_Supply+Accel (C7_1.2 D3_1.1 U1_1.2 U3_1.2), SIM808+RF (10 pins)
: MCU+Power_Supply+Accel (AVR128DA32.13), SIM808+RF (IC1_2.16)
AVR_USART0_RX: MCU+Power_Supply+Accel (AVR128DA32.31 TP4_1.1), SIM808+RF (R8_2.1)
AVR_USART0_TX: MCU+Power_Supply+Accel (AVR128DA32.30 TP5_1.1), SIM808+RF (R6_2.1)
SIM808_DTRPIN: MCU+Power_Supply+Accel (AVR128DA32.15), SIM808+RF (R7_2.1)
SIM808_PWRKEY: MCU+Power_Supply+Accel (AVR128DA32.14), SIM808+RF (R4_2.1)

## Assembly variants
Variant of GPS_TRACKER1: not fitted C17_1 C18_1 C? R6_1 R9_2 R10_2 R? R? R?